# EAGLE board monitoring_board (EAGLE 9.5.1), part 1 of 2
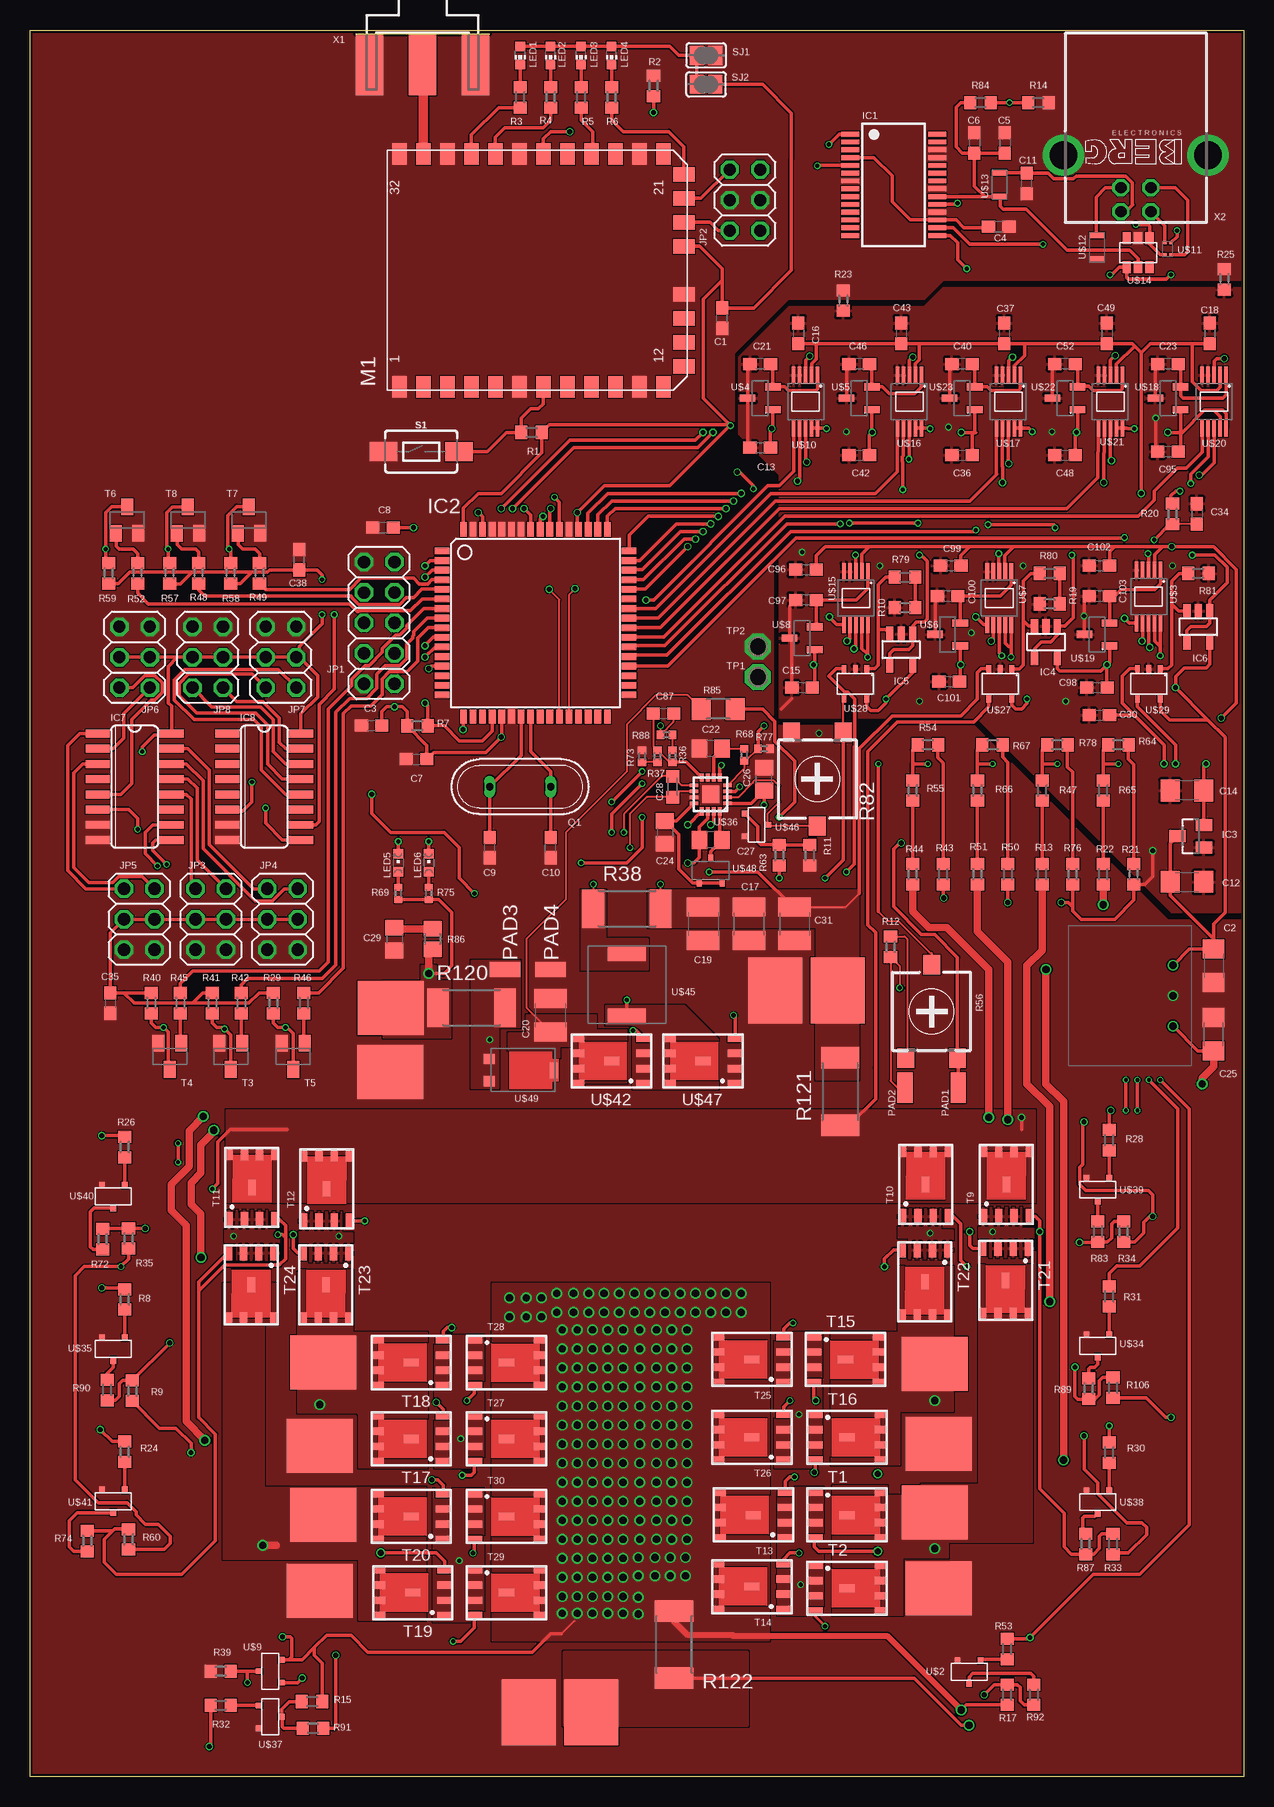
[diagram p6: board, top side]
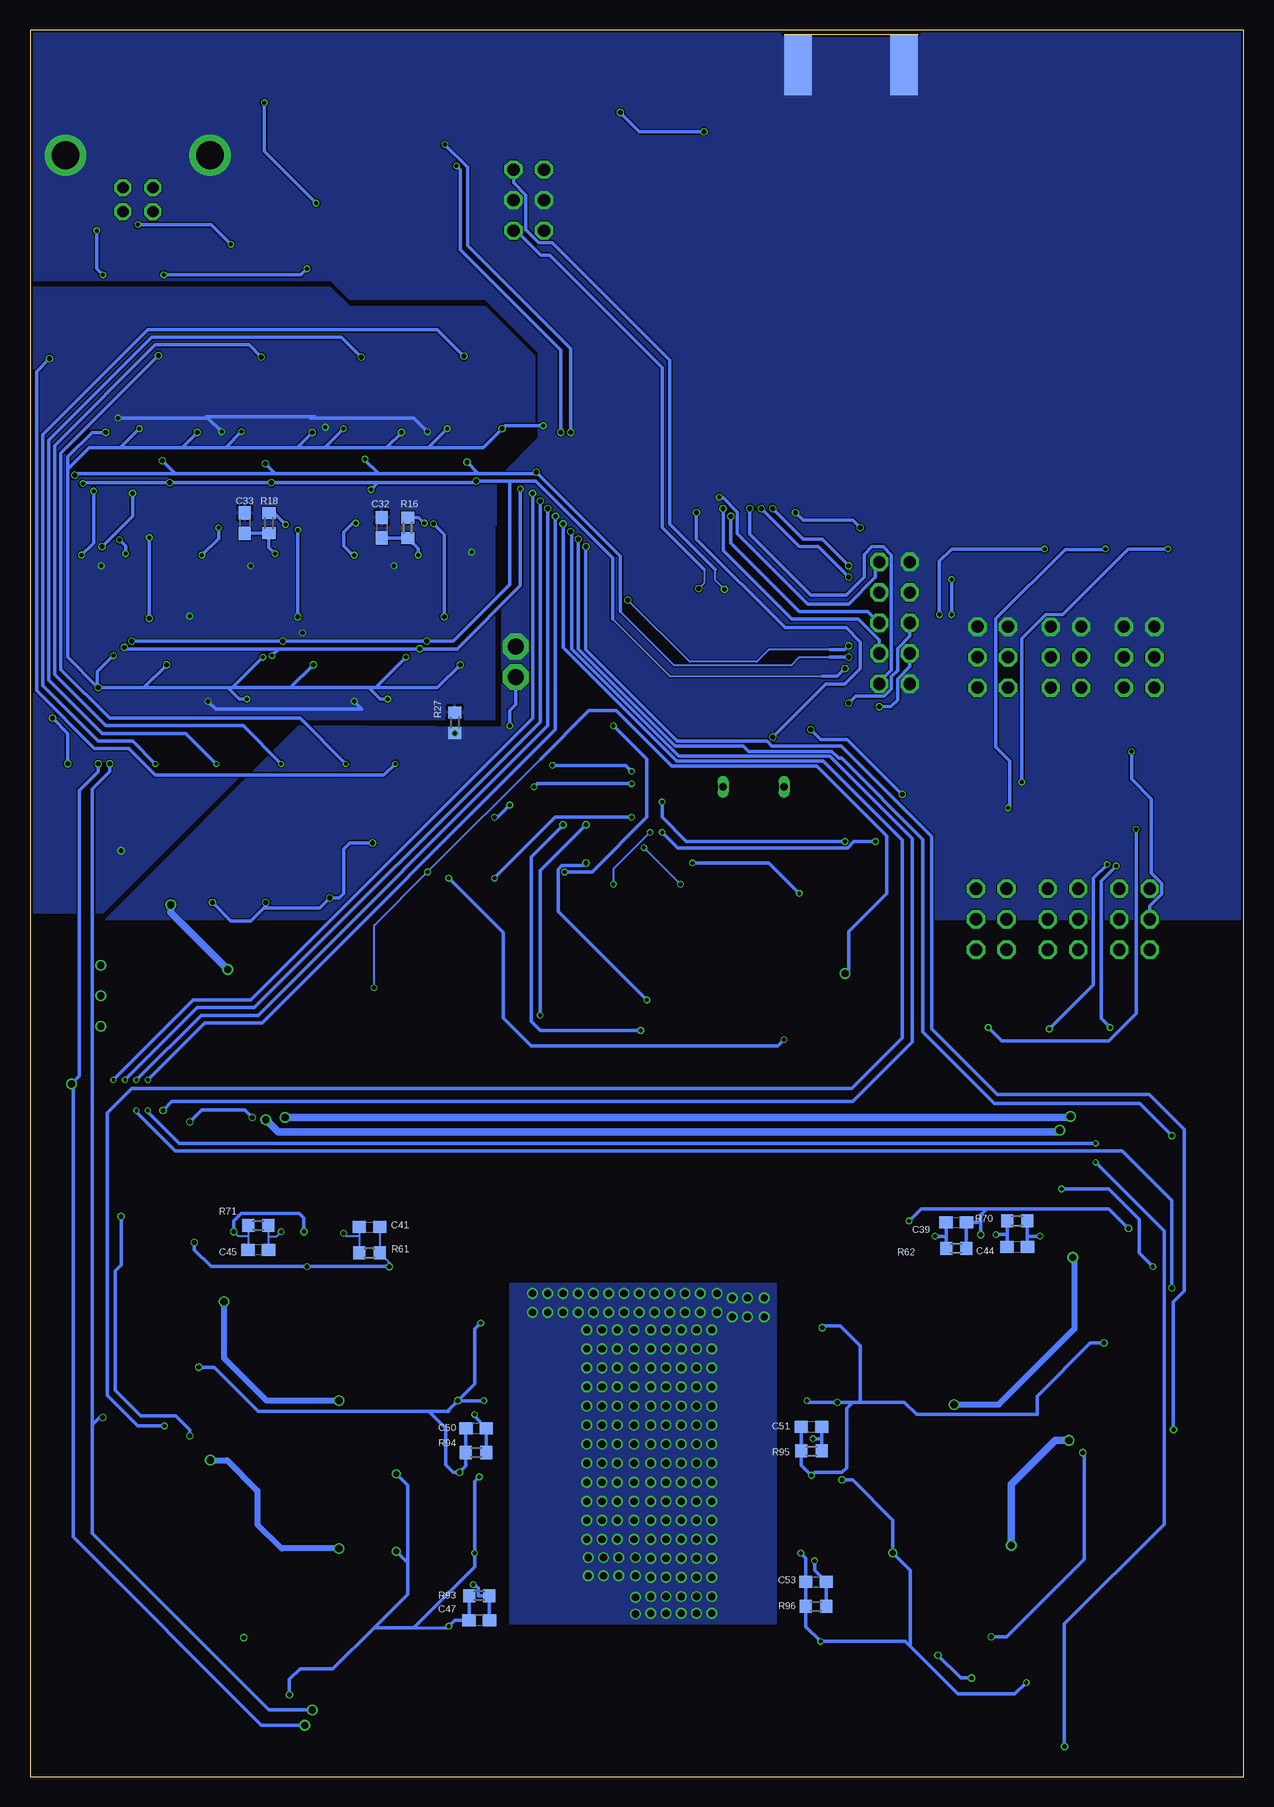
[diagram p7: board, bottom side, seen from below]

Size 101.15 x 145.61 mm. Coordinates in mm from the lower left corner, seen from the top.
Outline: 0,145.61 101.15,145.61 101.15,0 0,0 0,145.61
Copper layers (1*16): Top 0.018mm / dielectric 1.55mm / Bottom 0.018mm
Design rules "Multi-CB_2L_100Êm-Tracks_OL35Êm": minimum track width 0.1mm, minimum drill 0.2mm, track to track 0.1mm, track to pad 0.1mm, pad to pad 0.1mm, via to via 0.1mm, smd to smd 0mil, copper to edge 0.2mm, drill to drill 0.2mm, minimum pad ring 0.125mm, minimum via ring 0.1mm, stop-mask expansion 2mil, vias tented up to drill 0.45mm, thermal gap 0.2mm
Net classes: 1 ant: width 0.8 mm, clearance 0.1 mm

## Footprints (pad centres in the part's own frame; a part is rotated, then mirrored left to right if it is on the bottom)
SMDPAD = smd 4.5 x 5.5: 1 0.03,0.02
C0603 = smd 1.1 x 1: 1 -0.85,0; 2 0.85,0
C1206 = smd 1.6 x 1.8: 1 -1.4,0; 2 1.4,0
C1210 = smd 1.6 x 2.7: 1 -1.4,0; 2 1.4,0
C0805 = smd 1.3 x 1.5: 1 -0.95,0; 2 0.95,0
C0603K = smd 1.05 x 1.08: 1 -0.875,0; 2 0.875,0
SSOP28 = smd 0.4 x 1.5: 1 -4.225,-3.625; 2 -3.575,-3.625; 3 -2.925,-3.625; 4 -2.275,-3.625; 5 -1.625,-3.625; 6 -0.975,-3.625; 7 -0.325,-3.625; 8 0.325,-3.625; 9 0.975,-3.625; 10 1.625,-3.625; 11 2.275,-3.625; 12 2.925,-3.625; 13 3.575,-3.625; 14 4.225,-3.625; 15 4.225,3.625; 16 3.575,3.625; 17 2.925,3.625; 18 2.275,3.625; 19 1.625,3.625; 20 0.975,3.625; 21 0.325,3.625; 22 -0.325,3.625; 23 -0.975,3.625; 24 -1.625,3.625; 25 -2.275,3.625; 26 -2.925,3.625; 27 -3.575,3.625; 28 -4.225,3.625
TQFP64 = smd 1.194 x 0.559: 1 -7.8,6; 2 -7.8,5.2; 3 -7.8,4.4; 4 -7.8,3.6; 5 -7.8,2.8; 6 -7.8,2; 7 -7.8,1.2; 8 -7.8,0.4; 9 -7.8,-0.4; 10 -7.8,-1.2; 11 -7.8,-2; 12 -7.8,-2.8; 13 -7.8,-3.6; 14 -7.8,-4.4; 15 -7.8,-5.2; 16 -7.8,-6; 33 7.8,-6; 34 7.8,-5.2; 35 7.8,-4.4; 36 7.8,-3.6; 37 7.8,-2.8; 38 7.8,-2; 39 7.8,-1.2; 40 7.8,-0.4; 41 7.8,0.4; 42 7.8,1.2; 43 7.8,2; 44 7.8,2.8; 45 7.8,3.6; 46 7.8,4.4; 47 7.8,5.2; 48 7.8,6 | smd 0.559 x 1.194: 17 -6,-7.8; 18 -5.2,-7.8; 19 -4.4,-7.8; 20 -3.6,-7.8; 21 -2.8,-7.8; 22 -2,-7.8; 23 -1.2,-7.8; 24 -0.4,-7.8; 25 0.4,-7.8; 26 1.2,-7.8; 27 2,-7.8; 28 2.8,-7.8; 29 3.6,-7.8; 30 4.4,-7.8; 31 5.2,-7.8; 32 6,-7.8; 49 6,7.8; 50 5.2,7.8; 51 4.4,7.8; 52 3.6,7.8; 53 2.8,7.8; 54 2,7.8; 55 1.2,7.8; 56 0.4,7.8; 57 -0.4,7.8; 58 -1.2,7.8; 59 -2,7.8; 60 -2.8,7.8; 61 -3.6,7.8; 62 -4.4,7.8; 63 -5.2,7.8; 64 -6,7.8
SOT23 = smd 1 x 1.4: 1 -0.95,-1.1; 2 0.95,-1.1; 3 0,1.1
SOT23-5 = smd 0.6 x 1.2: 1 -0.95,-1.306; 2 0,-1.306; 3 0.95,-1.306; 4 0.95,1.306; 5 -0.95,1.306
SO16 = smd 0.66 x 2.032: 1 -4.445,-3.073; 2 -3.175,-3.073; 3 -1.905,-3.073; 4 -0.635,-3.073; 5 0.635,-3.073; 6 1.905,-3.073; 7 3.175,-3.073; 8 4.445,-3.073; 9 4.445,3.073; 10 3.175,3.073; 11 1.905,3.073; 12 0.635,3.073; 13 -0.635,3.073; 14 -1.905,3.073; 15 -3.175,3.073; 16 -4.445,3.073
2X05 = drill 1.016 octagon: 1 -5.08,-1.27; 2 -5.08,1.27; 3 -2.54,-1.27; 4 -2.54,1.27; 5 0,-1.27; 6 0,1.27; 7 2.54,-1.27; 8 2.54,1.27; 9 5.08,-1.27; 10 5.08,1.27
2X03 = drill 1.016 octagon: 1 -2.54,-1.27; 2 -2.54,1.27; 3 0,-1.27; 4 0,1.27; 5 2.54,-1.27; 6 2.54,1.27
CHIP-LED0603 = smd 0.8 x 0.8: A 0,-0.75; C 0,0.75
CHIPLED_0603 = smd 0.8 x 0.8: A 0,-0.75; C 0,0.75
IM-X8X = smd 1.8 x 1.2: P$1 0,-2; P$2 0,-4; P$3 0,-6; P$4 0,-8; P$5 0,-10; P$6 0,-12; P$7 0,-14; P$8 0,-16; P$9 0,-18; P$10 0,-20; P$11 0,-22; P$12 0,-24; P$21 19.4,-24; P$22 19.4,-22; P$23 19.4,-20; P$24 19.4,-18; P$25 19.4,-16; P$26 19.4,-14; P$27 19.4,-12; P$28 19.4,-10; P$29 19.4,-8; P$30 19.4,-6; P$31 19.4,-4; P$32 19.4,-2 | smd 1.2 x 1.8: P$13 1.7,-25.7; P$14 3.7,-25.7; P$15 5.7,-25.7; P$16 7.7,-25.7; P$17 11.7,-25.7; P$18 13.7,-25.7; P$19 15.7,-25.7; P$20 17.7,-25.7
SMD1,27-2,54 = smd 1.27 x 2.54: 1 0,0
QS = drill 0.61 long: 1 -2.54,0; 2 2.54,0
R0603 = smd 1 x 1.1: 1 -0.85,0; 2 0.85,0
R0402 = smd 0.6 x 0.7: 1 -0.5,0; 2 0.5,0
R2512 = smd 1.8 x 3.2: 1 -2.8,0; 2 2.8,0
RTRIMCA6 = smd 1.4 x 1.6: 1 -2.15,-3.9; 2 0,3.9; 3 2.15,-3.9
R1206 = smd 1.6 x 1.803: 1 -1.422,0; 2 1.422,0
R2012 = smd 1.3 x 1.5: 1 -0.85,0; 2 0.85,0
TACTILE_SWITCH_SMD_6.0X3.5MM = smd 2.3 x 1.6: 1 -3.15,0; 2 3.15,0
SJ = smd 1.168 x 1.6: 1 -0.762,0; 2 0.762,0
SI7157DP = smd 1.27 x 0.61: 1 -2.67,1.905; 2 -2.67,0.635; 3 -2.67,-0.635; 4 -2.67,-1.905 | smd 1.02 x 0.61: 5 2.795,-1.905; 6 2.795,-0.635; 7 2.795,0.635; 8 2.795,1.905 | smd 1.27 x 0.635: 9 0,0
SOT23-BEC = smd 1 x 1.4: B -0.95,-1.1; C 0,1.1; E 0.95,-1.1
P1-13 = drill 1.321 pad 2.159 octagon: TP 0,0
TSR-1-XXXX = drill 0.6: P$1 -2.5,-3.6; P$2 0.04,-3.6; P$3 2.58,-3.6
NXP_BC847 = smd 0.48 x 0.55: 1 -0.95,-0.953; 2 0.95,-0.953; 3 0,0.953
MCP33131-05 = smd 1.4 x 0.3: 1 -2.18,1.04; 2 -2.18,0.54; 3 -2.18,0.04; 4 -2.18,-0.46; 5 -2.18,-0.96; 6 2.23,-0.96; 7 2.23,-0.46; 8 2.23,0.04; 9 2.23,0.54; 10 2.23,1.04
REF31XX-Q1 = smd 0.6 x 1.3: 1 0.95,1.05; 2 -0.95,1.05; 3 0,-1.05
NXP_BC857 = smd 0.48 x 0.55: 1 -0.95,-0.953; 2 0.95,-0.953; 3 0,0.953
DLP11SN900HL2 = smd 0.25 x 0.3: 1 -0.5,0.252; 2 0.501,0.252; 3 0.501,-0.252; 4 -0.5,-0.252
BLM21PG221SN1 = smd 0.5 x 1.25: 1 -1,0; 2 1,0
NUP2201MR6 = smd 0.7 x 1: 1 -0.95,-1.2; 2 0,-1.2; 3 0.95,-1.2; 4 -0.95,1.2; 5 0,1.2; 6 0.95,1.2
INA138 = smd 0.4 x 0.625: 1 0.95,1.25; 2 0,1.25; 3 -0.95,1.25; 4 -0.95,-1.25; 5 0.95,-1.25
BQ24650 = smd 0.7 x 0.3: 1 -1.4,0.75; 2 -1.4,0.25; 3 -1.4,-0.25; 4 -1.4,-0.75; 9 1.4,-0.75; 10 1.4,-0.25; 11 1.4,0.25; 12 1.4,0.75 | smd 0.3 x 0.7: 5 -0.75,-1.4; 6 -0.25,-1.4; 7 0.25,-1.4; 8 0.75,-1.4; 13 0.75,1.4; 14 0.25,1.4; 15 -0.25,1.4; 16 -0.75,1.4 | smd 1.45 x 1.45: EXP 0,0
SIR404DP = smd 1.27 x 0.61: 1 -2.67,1.905; 2 -2.67,0.635; 3 -2.67,-0.635; 4 -2.67,-1.905 | smd 1.02 x 0.61: 5 2.795,-1.905; 6 2.795,-0.635; 7 2.795,0.635; 8 2.795,1.905 | smd 1.27 x 0.635: 9 0,0
IHLP-2525CZ-01 = smd 1.27 x 3.18: 1 -2.6,0; 2 2.6,0
2N7002 = smd 0.48 x 0.55: 1 -0.95,-0.953; 2 0.95,-0.953; 3 0,0.953
BAT54C = smd 0.4 x 0.6: 1 -0.95,-1.05; 2 0.95,-1.05; 3 0,1.05
PDS1040 = smd 0.89 x 0.85: 1 -2.83,0.92; 2 -2.83,-0.92 | smd 0.635 x 1.27: P$1 2.54,0
J502-ND-142-0701-801/806 = smd 5.08 x 2.286: 1 2.565,0; G@1 2.565,4.42; G@2 2.565,-4.42 | smd 5.08 x 2.286 bottom: G@3 2.565,4.42; G@4 2.565,-4.42
PN61729-S = drill 0.95 octagon: 1 1.25,4.71; 2 -1.25,4.71; 3 -1.25,2.71; 4 1.25,2.71 | drill 2.3 pad 2.9: S1 -6.02,0; S2 6.02,0

## Placement (x,y rotation side)
+V_LOAD  SMDPAD  [SMDPAD]  46.82,5.38 180 top
BAT0+  SMDPAD  [SMDPAD]  75.39,22.08 270 top
BAT0-  SMDPAD  [SMDPAD]  75.71,15.73 270 top
BAT1+  SMDPAD  [SMDPAD]  75.39,34.46 270 top
BAT1-  SMDPAD  [SMDPAD]  75.71,27.8 270 top
BAT2+  SMDPAD  [SMDPAD]  24.47,34.53 90 top
BAT2-  SMDPAD  [SMDPAD]  24.15,27.54 90 top
BAT3+  SMDPAD  [SMDPAD]  24.47,21.83 90 top
BAT3-  SMDPAD  [SMDPAD]  24.15,15.48 90 top
C1  1u/6,3V  [C0603]  57.68,121.59 90 top
C2  10u/5,6V  [C1206]  98.63,67.61 270 top
C3  100n  [C0603]  28.47,87.61 0 top
C4  100n  [C0603]  80.73,129.21 180 top
C5  4.7u  [C0603]  81.24,136.19 270 top
C6  100n  [C0603]  78.7,136.19 270 top
C7  100n  [C0603]  32.21,84.82 0 top
C8  100n  [C0603]  29.42,104.12 180 top
C9  22p  [C0603]  38.31,77.45 90 top
C10  22p  [C0603]  43.39,77.45 90 top
C11  10n  [C0603]  83.08,132.83 90 top
C12  1u/5,6V  [C1206]  96.41,74.6 0 top
C13  100n  [C0603]  60.85,110.79 0 top
C14  1u/5.6V  [C1206]  96.41,82.22 180 top
C15  100n  [C0603]  64.34,90.79 0 top
C16  100n  [C0603]  64.03,120.32 270 top
C17  22u/35V  [C1210]  59.9,71.1 270 top
C18  100n  [C0603]  98.32,120.32 270 top
C19  10uF/35V  [C1210]  56.09,71.1 270 top
C20  10uF  [C1210]  43.39,63.48 90 top
C21  10u  [C0603]  60.85,117.78 180 top
C22  1uF  [C0805]  56.73,85.71 180 top
C23  10u  [C0603]  94.82,117.78 180 top
C24  1uF  [C0805]  52.91,78.72 270 top
C25  47u/25V  [C1206]  98.63,61.9 90 top
C26  1uF  [C0805]  61.17,83.17 90 top
C27  100nF  [C0805]  56.73,78.09 180 top
C28  0.1uF  [C0603K]  53.55,82.53 90 top
C29  2.2uF  [C0805]  30.37,69.83 270 top
C30  100n  [C0603]  89.11,88.5 0 top
C31  10uF/35V  [C1210]  63.71,71.1 270 top
C32  3300p  [C0603]  71.84,104.12 270 bottom
C33  3300p  [C0603]  83.27,104.5 270 bottom
C34  3300p  [C0603]  97.24,105.27 270 top
C35  100n  [C0603]  6.69,64.5 270 top
C36  100n  [C0603]  77.68,110.16 0 top
C37  100n  [C0603]  81.17,120.32 270 top
C38  100n  [C0603]  22.43,101.46 90 top
C39  100n  [C0603]  23.96,46.21 0 bottom
C40  10u  [C0603]  77.68,117.78 180 top
C41  100n  [C0603]  72.85,45.83 0 bottom
C42  100n  [C0603]  69.11,110.16 0 top
C43  100n  [C0603]  72.6,120.32 270 top
C44  100n  [C0603]  18.88,44.18 0 bottom
C45  100n  [C0603]  82.12,43.93 180 bottom
C46  10u  [C0603]  69.11,117.78 180 top
C47  100n  [C0603]  63.71,13.06 0 bottom
C48  100n  [C0603]  86.25,110.16 0 top
C49  100n  [C0603]  89.75,120.32 270 top
C50  100n  [C0603]  63.96,29.07 0 bottom
C51  100n  [C0603]  36.02,29.19 0 bottom
C52  10u  [C0603]  86.25,117.78 180 top
C53  100n  [C0603]  35.64,16.24 0 bottom
C87  22p  [C0603]  52.79,88.63 0 top
C95  100n  [C0603]  94.82,110.47 0 top
C96  100n  [C0603]  64.66,100.63 0 top
C97  10u  [C0603]  64.66,98.09 180 top
C98  100n  [C0603]  88.92,90.79 0 top
C99  100n  [C0603]  76.73,100.95 0 top
C100  10u  [C0603]  76.47,98.41 180 top
C101  100n  [C0603]  76.6,91.3 0 top
C102  100n  [C0603]  89.11,100.95 0 top
C103  10u/5.6V  [C0603]  89.11,98.41 180 top
IC1  FT232RL  [SSOP28]  71.97,132.7 270 top
IC2  MEGA64-A  [TQFP64]  42.12,96.19 0 top
IC3  MCP1703CB  [SOT23]  96.73,78.41 90 top
IC4  OPA340N  [SOT23-5]  84.66,94.6 180 top
IC5  OPA340N  [SOT23-5]  72.6,93.96 180 top
IC6  OPA340N  [SOT23-5]  97.37,95.87 180 top
IC7  4052D  [SO16]  8.72,82.53 270 top
IC8  4052D  [SO16]  19.51,82.53 270 top
JP1  [2X05]  29.1,96.19 90 top
JP2  [2X03]  59.58,131.43 90 top
JP3  [2X03]  15.07,71.48 270 top
JP4  [2X03]  21.04,71.48 270 top
JP5  [2X03]  9.1,71.48 270 top
JP6  [2X03]  8.72,93.33 90 top
JP7  [2X03]  20.91,93.33 90 top
JP8  [2X03]  14.81,93.33 90 top
LED1  green  [CHIP-LED0603]  40.85,143.49 180 top
LED2  green  [CHIP-LED0603]  43.39,143.49 180 top
LED3  green  [CHIP-LED0603]  45.93,143.49 180 top
LED4  green  [CHIP-LED0603]  48.47,143.49 180 top
LED5  green  [CHIPLED_0603]  30.69,76.18 0 top
LED6  green  [CHIPLED_0603]  33.23,76.18 0 top
M1  IM-X8X  [IM-X8X]  28.79,115.87 90 top
PAD1  V-R56  [SMD1,27-2,54]  77.36,57.45 0 top
PAD2  V+R56  [SMD1,27-2,54]  72.92,57.45 0 top
PAD3  V+R82  [SMD1,27-2,54]  39.58,67.29 90 top
PAD4  V-R82  [SMD1,27-2,54]  43.39,67.29 90 top
Q1  7.3728 MHz  [QS]  40.85,82.53 180 top
R1  47k  [R0603]  41.8,112.06 180 top
R2  47k  [R0603]  51.96,140.95 270 top
R3  47k  [R0603]  40.85,140 90 top
R4  47k  [R0603]  43.39,140 90 top
R5  47k  [R0603]  45.93,140 90 top
R6  47k  [R0603]  48.47,140 90 top
R7  47k  [R0603]  32.28,87.61 180 top
R8  1k  [R0603]  7.89,39.8 90 top
R9  18k  [R0603]  8.53,32.18 270 top
R10  0R  [R0603]  72.92,97.46 0 top
R11  1k  [R0603]  64.98,76.82 90 top
R12  50k  [R0603]  71.71,69.2 90 top
R13  10k  [R0603]  84.35,75.23 90 top
R14  10k  [R0603]  84.03,139.56 0 top
R15  18k  [R0603]  23.51,6.27 0 top
R16  500R  [R0603]  69.68,104.12 270 bottom
R17  18k  [R0603]  81.43,6.84 270 top
R18  500R  [R0603]  81.24,104.5 270 bottom
R19  0R  [R0603]  84.98,97.77 0 top
R20  500  [R0603]  95.21,105.27 270 top
R21  3k9  [R0603]  91.97,75.23 270 top
R22  10k  [R0603]  89.43,75.23 90 top
R23  0R  [R0603]  67.77,123.05 270 top
R24  1k  [R0603]  7.89,27.1 270 top
R25  0R  [R0603]  99.52,124.83 270 top
R26  1k  [R0603]  7.89,52.5 270 top
R27  0R  [R0603]  65.74,87.87 90 bottom
R28  1k  [R0603]  89.94,53.07 270 top
R29  10k  [R0603]  20.28,64.5 90 top
R30  1k  [R0603]  89.94,27.04 270 top
R31  1k  [R0603]  89.94,40.05 90 top
R32  1k  [R0603]  15.89,5.95 180 top
R33  1k  [R0603]  90.25,19.41 270 top
R34  1k  [R0603]  91.14,45.45 270 top
R35  1k  [R0603]  8.21,44.88 270 top
R36  150k 1%  [R0402]  53.55,85.07 90 top
R37  100k 1%  [R0402]  52.28,85.07 90 top
R38  0R0065  [R2512]  49.74,72.37 0 top
R39  1k  [R0603]  15.89,8.81 0 top
R40  10k  [R0603]  10.12,64.5 90 top
R41  10k  [R0603]  15.2,64.5 90 top
R42  1k  [R0603]  17.61,64.5 90 top
R43  3k9  [R0603]  76.09,75.23 270 top
R44  10k  [R0603]  73.55,75.23 90 top
R45  1k  [R0603]  12.53,64.5 90 top
R46  1k  [R0603]  22.82,64.5 90 top
R47  0  [R0603]  84.35,82.22 270 top
R48  1k  [R0603]  14.05,100.31 270 top
R49  1k  [R0603]  19.13,100.31 270 top
R50  3k9  [R0603]  81.49,75.23 270 top
R51  10k  [R0603]  78.95,75.23 90 top
R52  1k  [R0603]  8.97,100.31 270 top
R53  1k  [R0603]  81.43,10.65 90 top
R54  0R  [R0603]  74.82,86.03 0 top
R55  0R  [R0603]  73.55,82.22 270 top
R56  10k  [RTRIMCA6]  75.14,63.8 0 top
R57  10k  [R0603]  11.64,100.31 90 top
R58  10k  [R0603]  16.72,100.31 90 top
R59  10k  [R0603]  6.56,100.31 90 top
R60  1k  [R0603]  8.21,19.8 270 top
R61  10k  [R0603]  72.85,43.67 180 bottom
R62  10k  [R0603]  23.96,44.05 180 bottom
R63  1k  [R0603]  62.44,76.82 270 top
R64  0  [R0603]  90.7,86.03 0 top
R65  0  [R0603]  89.43,82.22 270 top
R66  0R  [R0603]  78.95,82.22 270 top
R67  0R  [R0603]  80.22,86.03 0 top
R68  10k  [R0402]  59.52,85.2 90 top
R69  10k  [R0402]  30.69,73.64 90 top
R70  10k  [R0603]  18.88,46.34 180 bottom
R71  10k  [R0603]  82.12,45.96 0 bottom
R72  10  [R0603]  6.05,44.81 90 top
R73  0R  [R0402]  51.01,85.07 270 top
R74  10  [R0603]  4.78,19.67 90 top
R75  10k  [R0402]  33.23,73.64 90 top
R76  3k9  [R0603]  86.89,75.23 270 top
R77  15k  [R0402]  61.17,85.71 180 top
R78  0  [R0603]  85.62,86.03 0 top
R79  560K  [R0603]  72.92,100 180 top
R80  560k  [R0603]  84.98,100.31 180 top
R81  820k  [R0603]  97.37,100.31 180 top
R82  [RTRIMCA6]  65.61,83.17 180 top
R83  10  [R0603]  88.98,45.45 270 top
R84  4k7  [R0603]  79.2,139.56 0 top
R85  10R  [R1206]  57.36,89.01 0 top
R86  2R  [R2012]  33.55,69.83 270 top
R87  10  [R0603]  87.97,19.41 270 top
R88  150k 1%  [R0402]  53.04,86.85 180 top
R89  10  [R0603]  88.22,32.37 270 top
R90  10  [R0603]  6.43,32.24 270 top
R91  1k  [R0603]  23.58,4.05 180 top
R92  10  [R0603]  83.65,6.84 270 top
R93  10k  [R0603]  63.71,15.1 0 bottom
R94  10k  [R0603]  63.96,27.04 0 bottom
R95  10k  [R0603]  36.02,27.16 0 bottom
R96  10k  [R0603]  35.64,14.21 0 bottom
R106  18k  [R0603]  90.25,32.43 270 top
R120  0R003  [R2512]  36.79,64.12 0 top
R121  0R003  [R2512]  67.52,57.13 270 top
R122  500u  [R2512]  53.68,11.03 90 top
S1  MOMENTARY-SWITCH-SPST-SMD-6.0X3.5MM  [TACTILE_SWITCH_SMD_6.0X3.5MM]  32.59,110.47 0 top
SJ1  [SJ]  56.34,141.08 0 top
SJ2  [SJ]  56.34,143.49 180 top
SOLAR+  SMDPAD  [SMDPAD]  30.05,64.12 270 top
SOLAR-  SMDPAD  [SMDPAD]  30.05,58.72 90 top
SOLAR-1  SMDPAD  [SMDPAD]  67.27,65.52 0 top
SOLAR-2  SMDPAD  [SMDPAD]  62.06,65.52 0 top
T1  [SI7157DP]  68.09,21.83 0 top
T2  [SI7157DP]  68.09,15.73 0 top
T3  [SOT23-BEC]  16.72,60.05 180 top
T4  [SOT23-BEC]  11.64,60.05 180 top
T5  [SOT23-BEC]  21.93,60.05 180 top
T6  [SOT23-BEC]  8.08,104.76 0 top
T7  [SOT23-BEC]  18.24,104.76 0 top
T8  [SOT23-BEC]  13.16,104.76 0 top
T9  [SI7157DP]  81.36,49.39 90 top
T10  [SI7157DP]  74.63,49.39 90 top
T11  [SI7157DP]  18.5,49.13 90 top
T12  [SI7157DP]  24.72,49.01 90 top
T13  [SI7157DP]  60.28,21.83 180 top
T14  [SI7157DP]  60.15,15.86 180 top
T15  [SI7157DP]  67.96,34.78 0 top
T16  [SI7157DP]  68.09,28.3 0 top
T17  [SI7157DP]  31.77,28.18 180 top
T18  [SI7157DP]  31.77,34.53 180 top
T19  [SI7157DP]  31.9,15.35 180 top
T20  [SI7157DP]  31.77,21.7 180 top
T21  [SI7157DP]  81.3,41.39 270 top
T22  [SI7157DP]  74.57,41.26 270 top
T23  [SI7157DP]  24.66,41.01 270 top
T24  [SI7157DP]  18.43,41.01 270 top
T25  [SI7157DP]  60.15,34.78 180 top
T26  [SI7157DP]  60.15,28.3 180 top
T27  [SI7157DP]  39.71,28.18 0 top
T28  [SI7157DP]  39.71,34.53 0 top
T29  [SI7157DP]  39.71,15.35 0 top
T30  [SI7157DP]  39.71,21.7 0 top
TP1  PTR1PAD1-13  [P1-13]  60.66,91.68 0 top
TP2  PTR1PAD1-13  [P1-13]  60.66,94.22 0 top
U$1  TSR-1-XXXX  [TSR-1-XXXX]  91.65,65.07 90 top
U$2  NXP_BC847  [NXP_BC847]  78.25,8.75 180 top
U$3  MCP33131-05  [MCP33131-05]  93.17,98.41 270 top
U$4  REF3125-Q1  [REF31XX-Q1]  60.85,114.92 270 top
U$5  REF3125-Q1  [REF31XX-Q1]  69.11,114.92 270 top
U$6  REF3125-Q1  [REF31XX-Q1]  76.47,95.23 270 top
U$7  MCP33131-05  [MCP33131-05]  80.73,98.28 270 top
U$8  REF3125-Q1  [REF31XX-Q1]  64.34,94.92 270 top
U$9  NXP_BC857  [NXP_BC857]  20.02,8.81 90 top
U$10  MCP33131-05  [MCP33131-05]  64.6,114.66 270 top
U$11  DLP11SN900HL2  [DLP11SN900HL2]  94.82,127.36 90 top
U$12  BLM21PG221SN1  [BLM21PG221SN1]  88.92,127.49 270 top
U$13  BLM21PG221SN1  [BLM21PG221SN1]  80.79,132.7 90 top
U$14  DUP2201MR6  [NUP2201MR6]  92.35,127.05 180 top
U$15  MCP33131-05  [MCP33131-05]  68.79,98.28 270 top
U$16  MCP33131-05  [MCP33131-05]  73.23,114.66 270 top
U$17  MCP33131-05  [MCP33131-05]  81.49,114.66 270 top
U$18  REF3125-Q1  [REF31XX-Q1]  94.82,114.92 270 top
U$19  REF3125-Q1  [REF31XX-Q1]  88.92,95.23 270 top
U$20  MCP33131-05  [MCP33131-05]  98.63,114.66 270 top
U$21  MCP33131-05  [MCP33131-05]  90,114.66 270 top
U$22  REF3125-Q1  [REF31XX-Q1]  86.25,114.92 270 top
U$23  REF3125-Q1  [REF31XX-Q1]  77.68,114.92 270 top
U$27  INA138  [INA138]  80.85,91.11 0 top
U$28  INA138  [INA138]  68.79,91.11 0 top
U$29  INA138  [INA138]  93.24,91.11 0 top
U$34  NXP_BC847  [NXP_BC847]  88.98,35.92 180 top
U$35  NXP_BC847  [NXP_BC847]  6.94,35.67 180 top
U$36  BQ24650  [BQ24650]  56.73,81.9 180 top
U$37  NXP_BC847  [NXP_BC847]  20.02,5 270 top
U$38  NXP_BC847  [NXP_BC847]  88.98,22.91 180 top
U$39  NXP_BC847  [NXP_BC847]  88.98,48.94 180 top
U$40  NXP_BC847  [NXP_BC847]  6.94,48.37 180 top
U$41  NXP_BC847  [NXP_BC847]  6.94,22.97 180 top
U$42  SIR404DP  [SIR404DP]  48.47,59.67 180 top
U$45  4.7uH /Würth 784 778 047  [IHLP-2525CZ-01]  49.74,66.02 90 top
U$46  2N7002  [2N7002]  60.53,79.36 270 top
U$47  SIR404DP  [SIR404DP]  56.09,59.67 180 top
U$48  BAT54C  [BAT54C]  56.73,75.55 0 top
U$49  PDS1040  [PDS1040]  41.1,58.91 0 top
V_LOAD-  SMDPAD  [SMDPAD]  41.61,5.38 180 top
X1  SMA-142-0701-801/806  [J502-ND-142-0701-801/806]  32.72,145.27 270 top
X2  PN61729-S  [PN61729-S]  92.16,135.18 180 top